# Altium schematic sheet Sheet1.SchDoc
size A3; SheetNumber: 4; SheetTotal: 4
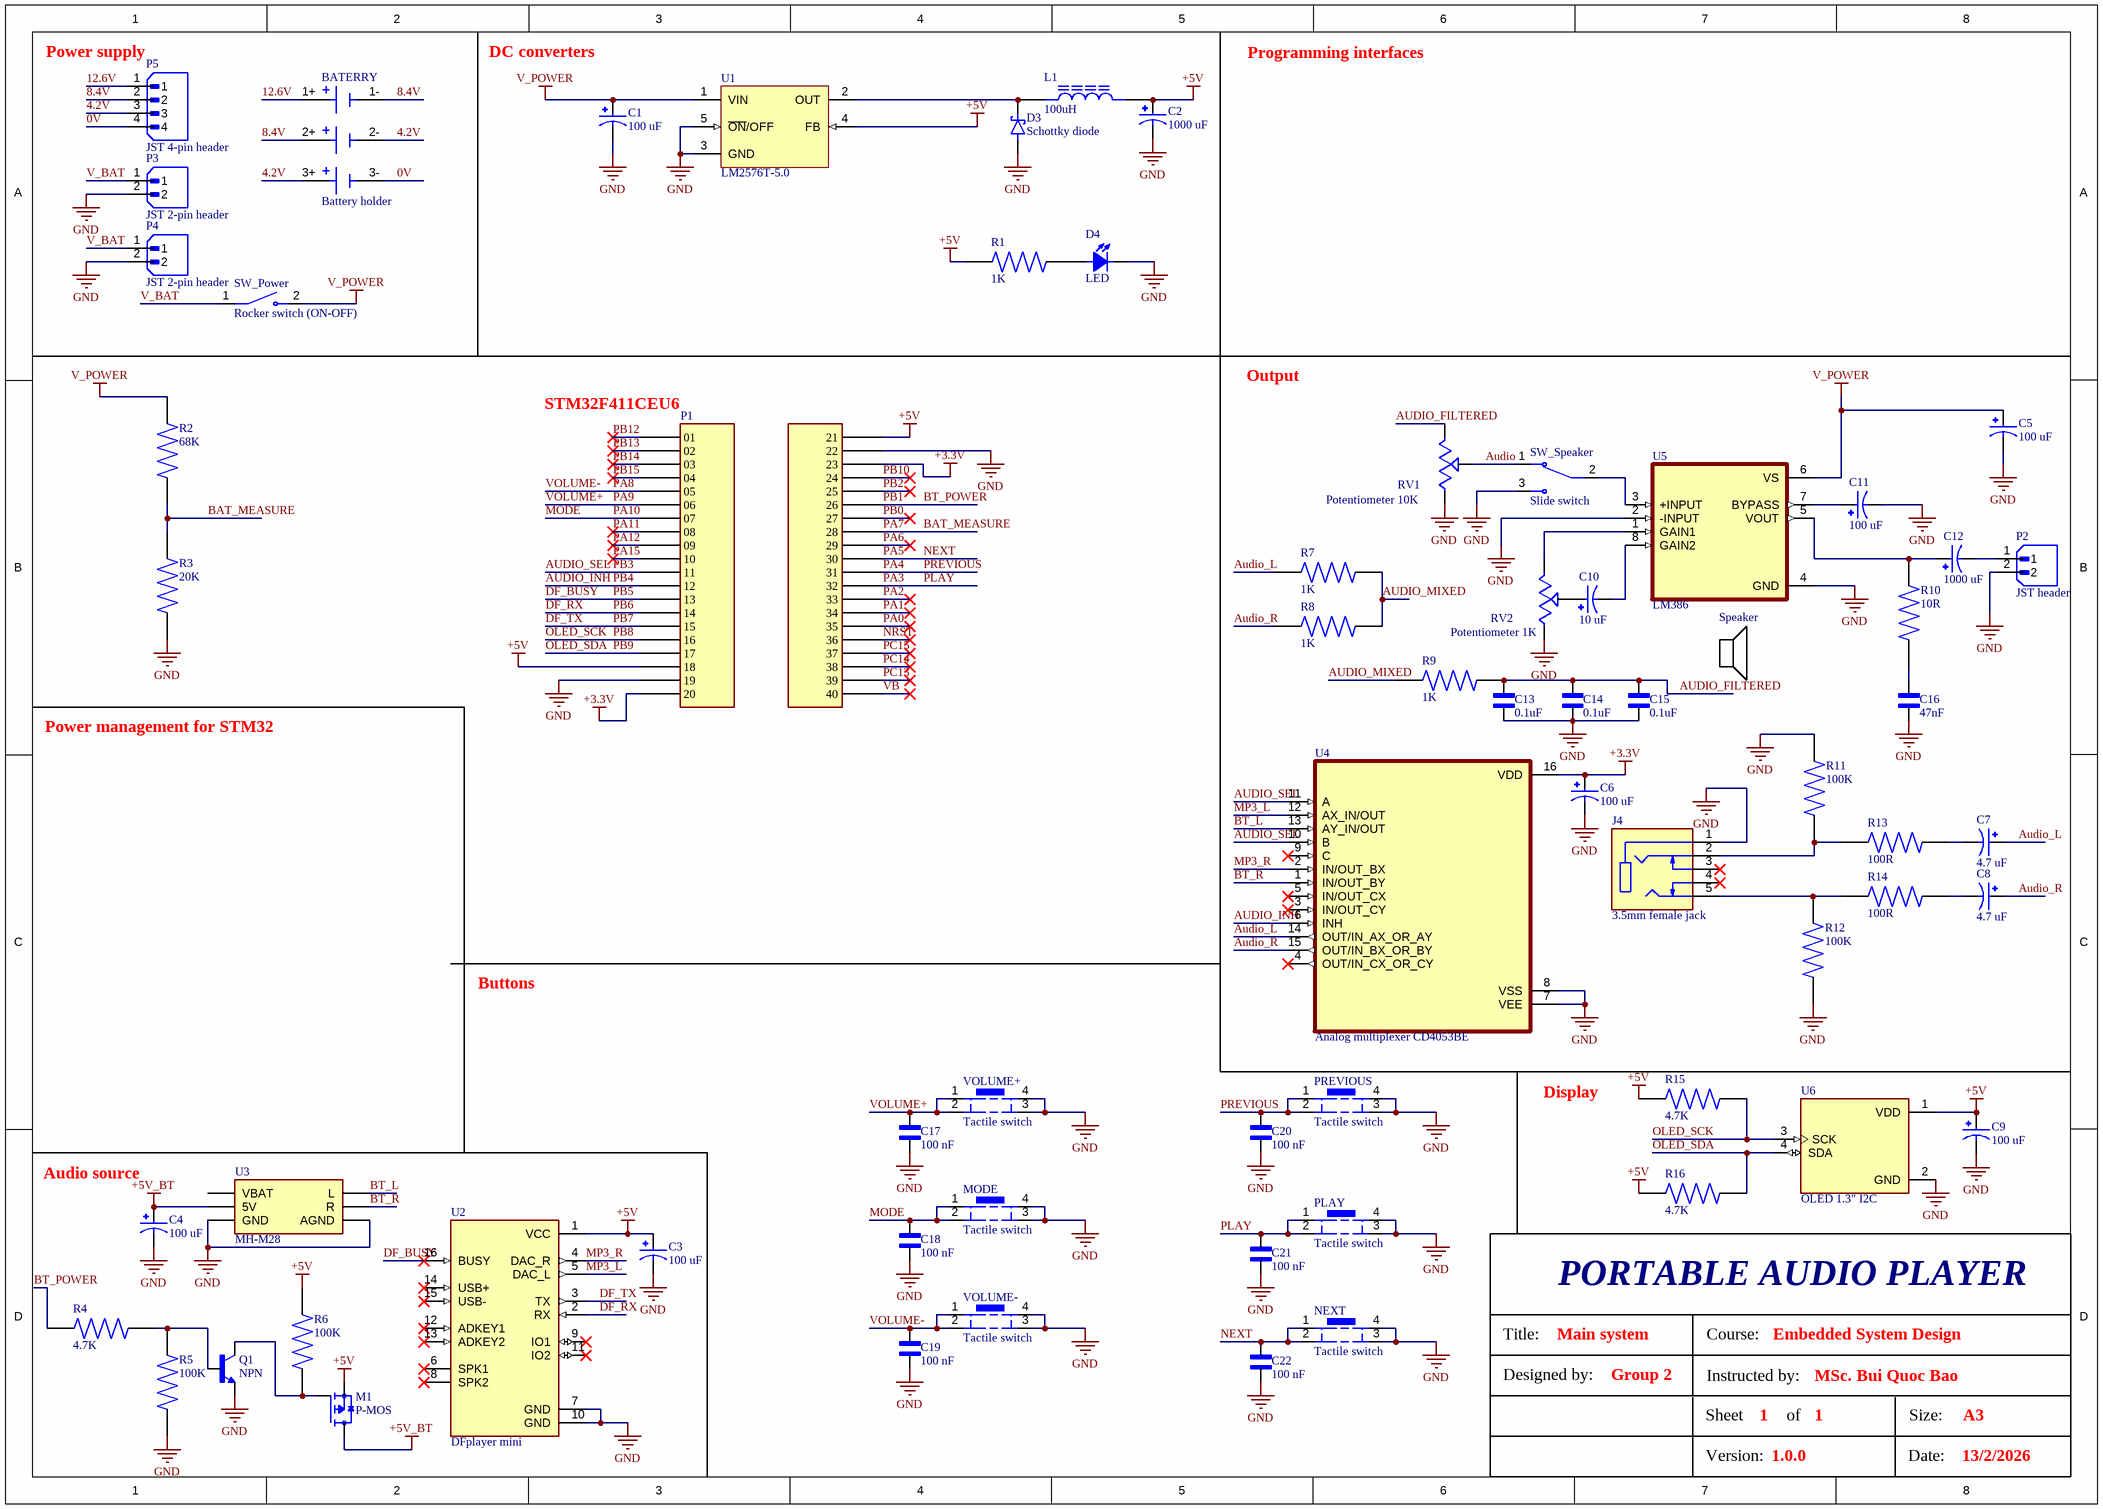
[diagram p0: Sheet1.SchDoc]

## Parts
BATERRY  Battery holder  [BAT_BK-18650-PC6]
C1  100 uF  [CAPPRD250W50D630H1120]
C2  1000 uF  [CAPPRD500W60D1000H2500]
C3  100 uF  [CAPPRD250W50D630H1120]
C4  100 uF  [CAPPRD250W50D630H1120]
C5  100 uF  [CAPPRD250W50D630H1120]
C6  100 uF  [CAPPRD250W50D630H1120]
C7  4.7 uF  [CAPPRD200W50D500H1100]
C8  4.7 uF  [CAPPRD200W50D500H1100]
C9  100 uF  [CAPPRD250W50D630H1120]
C10  10 uF  [CAPPRD200W50D500H1100]
C11  100 uF  [CAPPRD250W50D630H1120]
C12  1000 uF  [CAPPRD500W60D1000H2500]
C13  0.1uF  [CAPRR254W54L381T254H466]
C14  0.1uF  [CAPRR254W54L381T254H466]
C15  0.1uF  [CAPRR254W54L381T254H466]
C16  47nF  [CAPRR254W50L508T317H508]
C17  100 nF  [CAPRR254W54L381T254H466]
C18  100 nF  [CAPRR254W54L381T254H466]
C19  100 nF  [CAPRR254W54L381T254H466]
C20  100 nF  [CAPRR254W54L381T254H466]
C21  100 nF  [CAPRR254W54L381T254H466]
C22  100 nF  [CAPRR254W54L381T254H466]
D3  Schottky diode  [DIOAD1039W78L463D236]
D4  LED  [LED-TH-2.54mm]
J4  3.5mm female jack  [CLIFF_FC68133]
L1  100uH  [IND_RLB9012-101KL]
M1  P-MOS  [TO254P1067X483X2286-3]
MODE  Tactile switch  [Tactice-Switch-TH-12x12]
NEXT  Tactile switch  [Tactice-Switch-TH-12x12]
P1  2x20 female header for mounting Blackpill board  [Blackpill board mounting headers]  (value not drawn)
P2  JST header  [JST_B2B-XH-A]
P3  JST 2-pin header  [JST_B2B-XH-A]
P4  JST 2-pin header  [JST_B2B-XH-A]
P5  JST 4-pin header  [JST_B4B-XH-A]
PLAY  Tactile switch  [Tactice-Switch-TH-12x12]
PREVIOUS  Tactile switch  [Tactice-Switch-TH-12x12]
Q1  NPN  [TO92254P460H750-3]
R1  1K  [RESAD1100W55L680D260]
R2  68K  [RESAD1100W55L680D260]
R3  20K  [RESAD1100W55L680D260]
R4  4.7K  [RESAD1100W55L680D260]
R5  100K  [RESAD1100W55L680D260]
R6  100K  [RESAD1100W55L680D260]
R7  1K  [RESAD1100W55L680D260]
R8  1K  [RESAD1100W55L680D260]
R9  1K  [RESAD1100W55L680D260]
R10  10R  [RESAD1100W55L680D260]
R11  100K  [RESAD1100W55L680D260]
R12  100K  [RESAD1100W55L680D260]
R13  100R  [RESAD1100W55L680D260]
R14  100R  [RESAD1100W55L680D260]
R15  4.7K  [RESAD1100W55L680D260]
R16  4.7K  [RESAD1100W55L680D260]
RV1  Potentiometer 10K  [TRIM_WH148-1A-2-18T-L20]
RV2  Potentiometer 1K  [TRIM_WH148-1A-2-18T-L20]
Speaker  Speaker  [50mm speaker]  (value not drawn)
SW_Power  Rocker switch (ON-OFF)  [Rocker switch (ON-OFF)]
SW_Speaker  Slide switch  [SW_SLW-1276864-4A-D]
U1  LM2576T-5.0  [KC0005A]
U2  DFplayer mini  [MODULE_DFR0299]
U3  MH-M28  [MH-M28]
U4  Analog multiplexer CD4053BE  [DIP_16]
U5  LM386  [DIP_8]
U6  OLED 1.3" I2C  [LCD_OLED_128X64_1.3_I2C]
VOLUME+  Tactile switch  [Tactice-Switch-TH-12x12]
VOLUME-  Tactile switch  [Tactice-Switch-TH-12x12]

## Nets
+3.3V: C6.P P1.20 P1.23 U4.16(VDD)
+5V: C2.P C3.P C9.P L1.2 M1.3(S) P1.18 P1.21 R1.1 R6.2 R15.2 R16.1 U1.4(FB) U2.1(VCC) U6.1(VDD)
+5V_BT: C4.P M1.2(D) U3.5V
GND: C1.N C2.N C3.N C4.N C5.N C6.N C9.N C11.N C13.1 C14.1 C15.1 C16.1 C17.1 C18.1 C19.1 C20.1 C21.1 C22.1 D3.2(A) D4.2(K) J4.1 MODE.3 MODE.4 NEXT.3 NEXT.4 P1.19 P1.22 P2.2 P3.2 P4.2 PLAY.3 PLAY.4 PREVIOUS.3 PREVIOUS.4 Q1.1(E) R3.1 R5.1 R11.2 R12.2 RV1.3 RV2.3 SW_Speaker.3 U1.3(GND) U1.5(~{ON}/OFF) U2.7(GND) U2.10(GND) U3.AGND U3.GND U4.7(VEE) U4.8(VSS) U5.2(-INPUT) U5.4(GND) U6.2(GND) VOLUME+.3 VOLUME+.4 VOLUME-.3 VOLUME-.4
V_POWER: C1.P C5.P R2.2 SW_Power.2 U1.1(VIN) U5.6(VS)
0V: BATERRY.3- P5.4
4.2V: BATERRY.2- BATERRY.3+ P5.3
8.4V: BATERRY.1- BATERRY.2+ P5.2
12.6V: BATERRY.1+ P5.1
Audio: RV1.2 SW_Speaker.1
AUDIO_FILTERED: C13.2 C14.2 C15.2 R9.2 RV1.1
AUDIO_INH: P1.12 U4.6(INH)  [also labelled PB4]
Audio_L: C7.P R7.1 U4.14(OUT/IN_AX_OR_AY)
AUDIO_MIXED: R7.2 R8.2 R9.1
Audio_R: C8.P R8.1 U4.15(OUT/IN_BX_OR_BY)
AUDIO_SEL: P1.11 U4.10(B) U4.11(A)  [also labelled PB3]
BAT_MEASURE: P1.28 R2.1 R3.2  [also labelled PA7]
BT_L: U3.L U4.13(AY_IN/OUT)
BT_POWER: P1.26 R4.1  [also labelled PB1]
BT_R: U3.R U4.1(IN/OUT_BY)
DF_BUSY: P1.13 U2.16(BUSY)  [also labelled PB5]
DF_RX: P1.14 U2.2(RX)  [also labelled PB6]
DF_TX: P1.15 U2.3(TX)  [also labelled PB7]
MODE: C18.2 MODE.1 MODE.2 P1.7(07)  [also labelled PA10]
MP3_L: U2.5(DAC_L) U4.12(AX_IN/OUT)
MP3_R: U2.4(DAC_R) U4.2(IN/OUT_BX)
NEXT: C22.2 NEXT.1 NEXT.2 P1.30  [also labelled PA5]
NRST: P1.36
OLED_SCK: P1.16 R15.1 U6.3(SCK)  [also labelled PB8]
OLED_SDA: P1.17 R16.2 U6.4(SDA)  [also labelled PB9]
PA0: P1.35
PA1: P1.34
PA2: P1.33
PA3: C21.2 P1.32 PLAY.1 PLAY.2  [also labelled PLAY]
PA4: C20.2 P1.31 PREVIOUS.1 PREVIOUS.2  [also labelled PREVIOUS]
PA6: P1.29
PA8: C19.2 P1.5(05) VOLUME-.1 VOLUME-.2  [also labelled VOLUME-]
PA9: C17.2 P1.6(06) VOLUME+.1 VOLUME+.2  [also labelled VOLUME+]
PA11: P1.8(08)
PA12: P1.9(09)
PA15: P1.10
PB0: P1.27
PB2: P1.25
PB10: P1.24
PB12: P1.1(01)
PB13: P1.2(02)
PB14: P1.3(03)
PB15: P1.4(04)
PC13: P1.39
PC14: P1.38
PC15: P1.37
V_BAT: P3.1 P4.1 SW_Power.1
VB: P1.40
NetC7_N: C7.N R13.2
NetC8_N: C8.N R14.2
NetC10_N: C10.N U5.8(GAIN2)
NetC10_P: C10.P RV2.2
NetC11_P: C11.P U5.7(BYPASS)
NetC12_N: C12.N P2.1
NetC12_P: C12.P R10.1 U5.5(VOUT)
NetC16_2: C16.2 R10.2
NetD3_1: D3.1(K) L1.1 U1.2(OUT)
NetD4_1: D4.1(A) R1.2
NetJ4_2: J4.2 R11.1 R13.1
NetJ4_5: J4.5 R12.1 R14.1
NetM1_1: M1.1(G) Q1.3(C) R6.1
NetQ1_2: Q1.2(B) R4.2 R5.2
NetRV2_1: RV2.1 U5.1(GAIN1)
NetSW_Speaker_2: SW_Speaker.2 U5.3(+INPUT)

Not connected (* = marked no-connect by the designer): J4 3* 4*; U2 6(SPK1)* 8(SPK2)* 9(IO1)* 11(IO2)* 12(ADKEY1)* 13(ADKEY2)* 14(USB+)* 15(USB-)*; U3 VBAT; U4 3(IN/OUT_CY)* 4(OUT/IN_CX_OR_CY)* 5(IN/OUT_CX)* 9(C)*

## Notes on the sheet
- (near P5) Power supply
- (near C1) DC converters
- Programming interfaces
- Output
- (near P1) STM32F411CEU6
- Power management for STM32
- Buttons
- Display
- (near C4) Audio source
- PORTABLE AUDIO PLAYER
- Designed by:
- Title:
- Main system
- Group 2
- Instructed by:
- Course:
- Embedded System Design
- MSc. Bui Quoc Bao
- Version:
- Sheet
- 1
- 1.0.0
- of
- Date:
- Size:
- 13/2/2026
- A3
- DWG NO:
- REV:
- THIS DOCUMENT AND THE DATA DISCLOSED HEREIN OR
- HEREWITH IS THE PROPERTY OF ALTIUM LIMITED AND MAY
- BE FREELY DISTRIBUTED IN WHOLE. NO RIGHTS ARE
- RESERVED OR EXPRESS OR IMPLIED WARANTEE GIVEN.
- REVISION
- DESCRIPTION
- DATE
- APPROVED
- ENG:
- APPROVALS
- PROJECT
- DSN:
- CHK:
- REFERENCE DOCUMENTS
- PROJECT REVISION:
- TITLE
- DOCUMENT REVISION:
- DESIGN ITEM:
- BOM:
- FAB DWG:
- PCB DWG:
- ASSY DWG:
- SCALE:
- A2
- SIZE
- CAGE CODE
- FILE NAME
- DWG NO.
- SHEET
- OF
- REV

## Library data of the parts
U1 = CMP-0069-02002-3: SIMPLE SWITCHER® 3A Step-Down Voltage Regulator, 5-pin TO-220; Manufacturer: Texas Instruments; PowerWise: N; PackageTopMarking: NSUZXYTTE#*LM2576T*-5.0 P+; PackageReference: KC0005A; ComponentLink1Description: Datasheet URL; CompType: Switcher; Code_JEDEC: TO-220-AB; PackageDescription: TO-220, Molded, 5 Lead, Straight; RoHS: N; PinCount: 5; ComponentLink1URL: http://www.ti.com/general/docs/lit/getliterature.tsp?genericPartNumber=LM2576&fileType=pdf